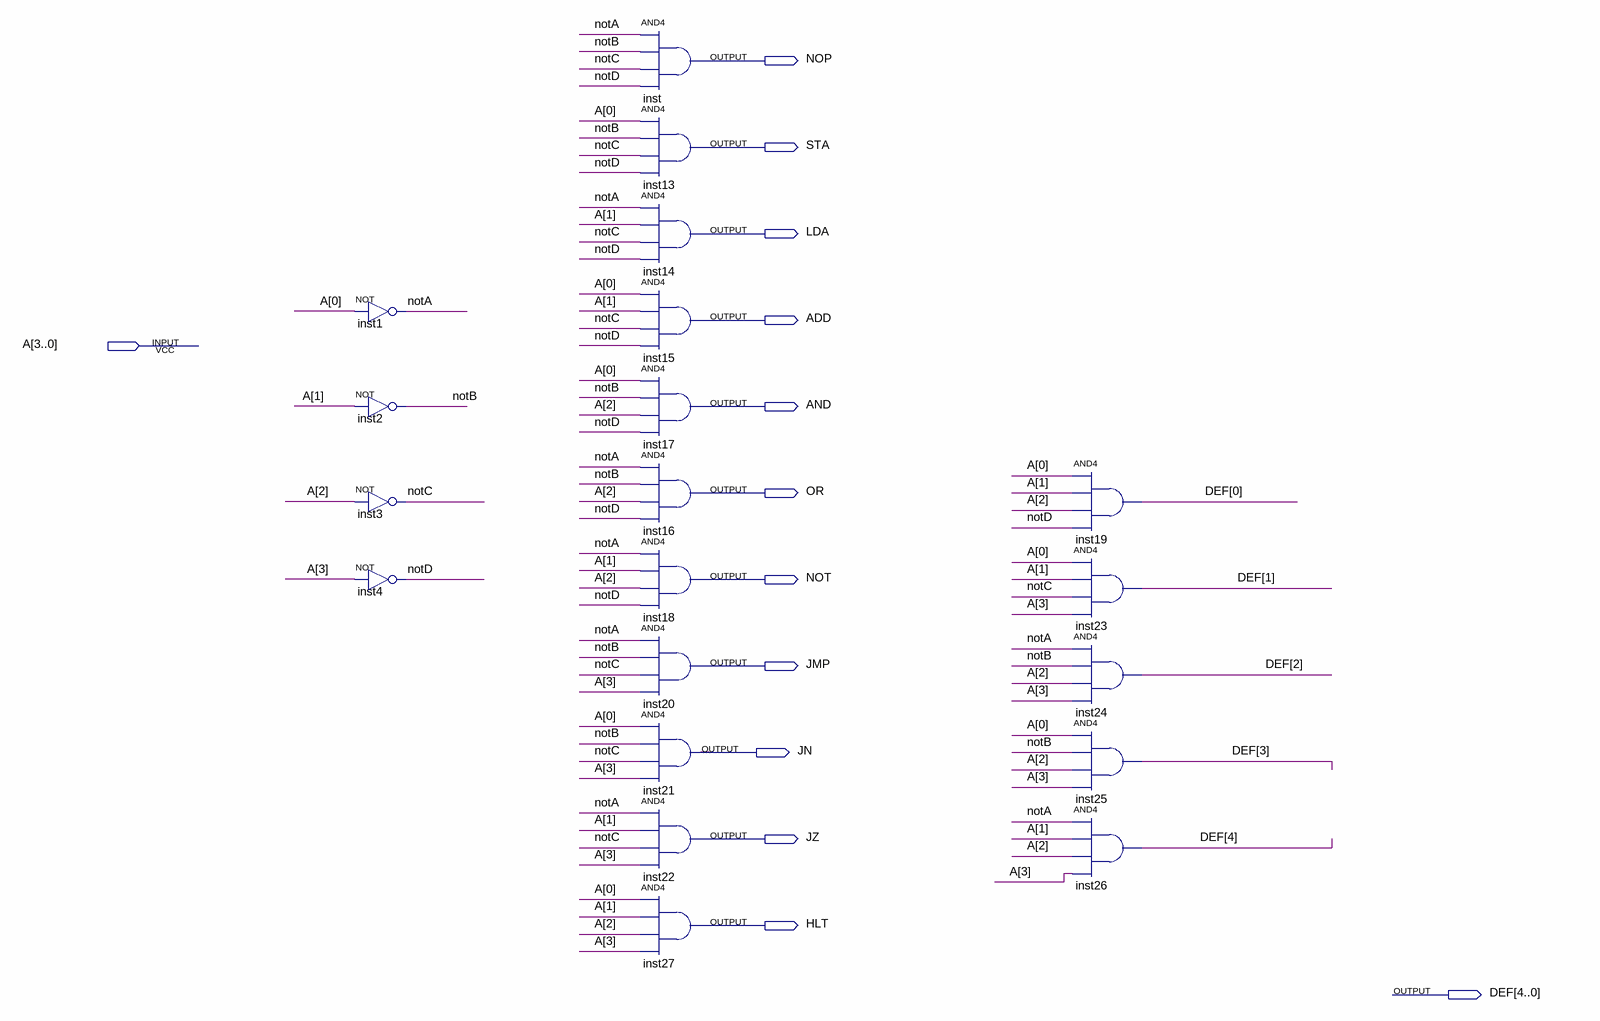
[diagram p0: schematic sheet]
// Quartus schematic Decoder.bdf as structural Verilog: 20 symbols, 13 pins
module Decoder (
  input  [3:0] A,
  output NOP,
  output STA,
  output LDA,
  output ADD,
  output AND,
  output OR,
  output NOT,
  output JMP,
  output JN,
  output JZ,
  output HLT,
  output [4:0] DEF
);

  wire notA, notB, notC, notD;

  not inst1 (notA, A[0]);
  not inst2 (notB, A[1]);
  not inst3 (notC, A[2]);
  not inst4 (notD, A[3]);
  and inst (NOP, notA, notB, notC, notD);
  and inst13 (STA, A[0], notB, notC, notD);
  and inst14 (LDA, notA, A[1], notC, notD);
  and inst15 (ADD, A[0], A[1], notC, notD);
  and inst17 (AND, A[0], notB, A[2], notD);
  and inst16 (OR, notA, notB, A[2], notD);
  and inst18 (NOT, notA, A[1], A[2], notD);
  and inst20 (JMP, notA, notB, notC, A[3]);
  and inst21 (JN, A[0], notB, notC, A[3]);
  and inst22 (JZ, notA, A[1], notC, A[3]);
  and inst27 (HLT, A[0], A[1], A[2], A[3]);
  and inst19 (DEF[0], A[0], A[1], A[2], notD);
  and inst23 (DEF[1], A[0], A[1], notC, A[3]);
  and inst24 (DEF[2], notA, notB, A[2], A[3]);
  and inst25 (DEF[3], A[0], notB, A[2], A[3]);
  and inst26 (DEF[4], notA, A[1], A[2], A[3]);
endmodule
